# EAGLE design encoder_wrist (EAGLE 6.1)
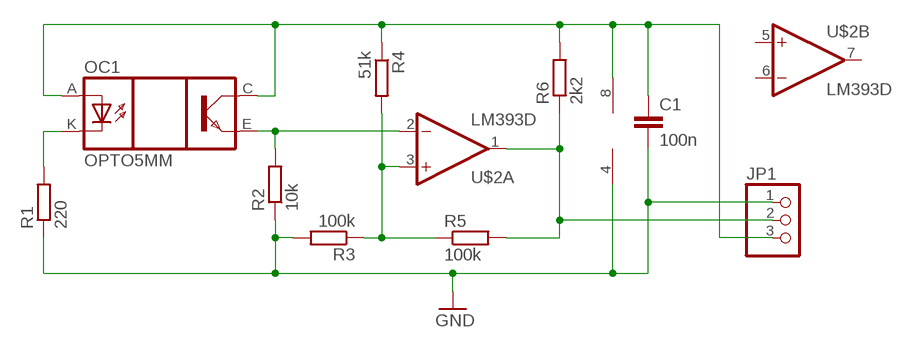
[diagram p0: schematic, sheet 1]

## Parts
C1  100n  C-EUC1206  [C1206]
JP1  PINHD-1X3/90  [1X03/90]
OC1  OPTO5MM  [OPTO_5MM]
R1  220  R-EU_M1206  [M1206]
R2  10k  R-EU_M1206  [M1206]
R3  100k  R-EU_M1206  [M1206]
R4  51k  R-EU_M1206  [M1206]
R5  100k  R-EU_M1206  [M1206]
R6  2k2  R-EU_M1206  [M1206]
U$2  LM393D  [SO08]

## Nets
GND: C1.2 JP1.1 R1.1 R2.1 R3.2 U$2.4(P:V-)
N$2: OC1.K(C) R1.2
N$3: R3.1 R4.2 R5.1 U$2.3(A:+IN)
N$5: JP1.2 R5.2 R6.1 U$2.1(A:OUT)
N$6: OC1.E(EMIT) R2.2 U$2.2(A:-IN)
N$8: C1.1 JP1.3 OC1.A OC1.C(COL) R4.1 R6.2 U$2.8(P:V+)
Unconnected: U$2.5(B:+IN) U$2.6(B:-IN) U$2.7(B:OUT)

## Library data of the parts
C1 = rcl:C-EU: CAPACITOR, European symbol
JP1 = pinhead:PINHD-1X3: PIN HEADER
OC1 = robot2:OPTO5MM
R1-R6 = rcl:R-EU_: RESISTOR, European symbol
U$2 = linear:LM393: COMPARATOR

## Board
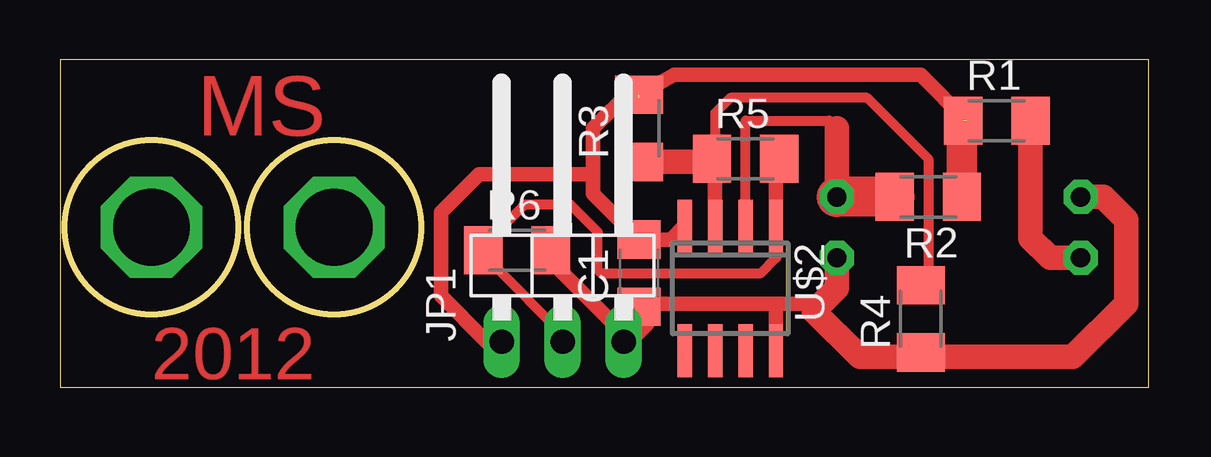
[diagram p1: board, top side]
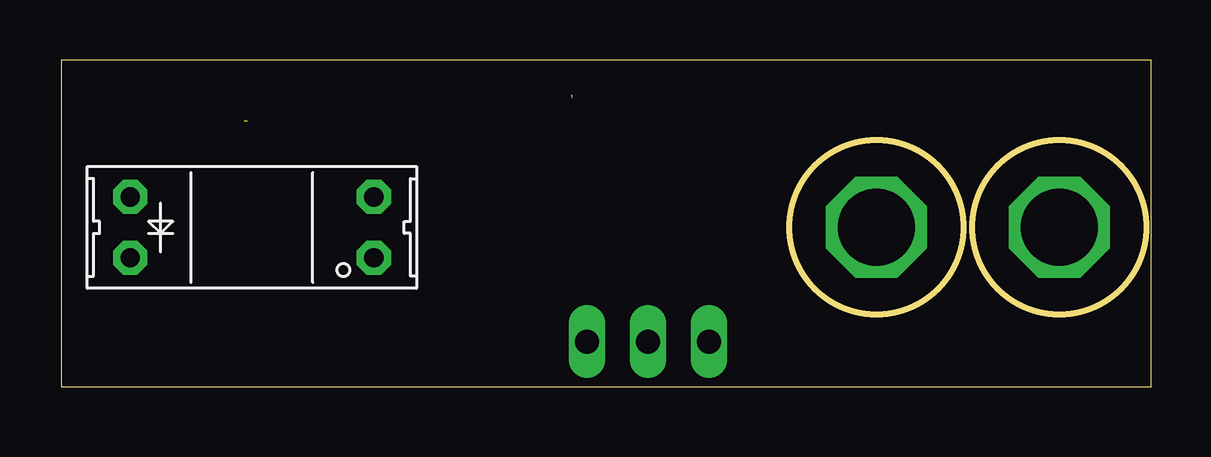
[diagram p2: board, bottom side, seen from below]

Size 45.39 x 13.64 mm. Coordinates in mm from the lower left corner, seen from the top.
Outline: 0,0 45.39,0 45.39,13.64 0,13.64 0,0
Outline: circle at 11.43,6.67 radius 3.62
Outline: circle at 3.81,6.67 radius 3.62
Copper layers (1*16): Top 0.035mm / dielectric 1.5mm / Bottom 0.035mm
Design rules: minimum track width 10mil, minimum drill 24mil, track to track 8mil, track to pad 8mil, pad to pad 8mil, via to via 8mil, smd to smd 8mil, copper to edge 40mil, drill to drill 8mil, minimum pad ring 10mil, minimum via ring 8mil, stop-mask expansion 4mil, vias tented up to drill 0mil, thermal gap 10mil

### Footprints (pad centres in the part's own frame; a part is rotated, then mirrored left to right if it is on the bottom)
C1206 = smd 1.6 x 1.8: 1 -1.4,0; 2 1.4,0
1X03/90 = drill 1.016 long: 1 -2.54,-3.81; 2 0,-3.81; 3 2.54,-3.81
OPTO_5MM = drill 0.8 pad 1.422 octagon: A 7.62,-2.54; C -2.54,0; E -2.54,-2.54; K 7.62,0
M1206 = smd 1.6 x 2: 1 -1.4,0; 2 1.4,0
SO08 = smd 0.6 x 2.2: 1 -1.905,-2.6; 2 -0.635,-2.6; 3 0.635,-2.6; 4 1.905,-2.6; 5 1.905,2.6; 6 0.635,2.6; 7 -0.635,2.6; 8 -1.905,2.6

### Placement (x,y rotation side)
C1  24.13,4.76 90 top
JP1  20.96,5.71 0 top
OC1  34.93,5.4 180 bottom
R1  39.05,11.11 0 top
R2  36.2,7.94 180 top
R3  24.13,10.79 90 top
R4  35.88,2.86 90 top
R5  28.58,9.53 0 top
R6  19.05,5.71 0 top
U$2  27.94,4.13 180 top

### Tracks (layer width: path | path; a pad name or v marks a point on that pad's centre or on a via)
GND  (2 unrouted)
  Top 0.61: U$2.4 25.47,6.16 C1.2 22.23,8.07 22.23,8.89 | R3.2 25.59,13.02 35.88,13.02 37.78,11.11 | 22.23,8.89 22.23,10.79 23.81,12.38 24.13,12.06 | JP1.1 17.78,1.91 15.88,3.81 15.88,7.3 17.46,8.89 22.23,8.89
  Top 1.27: R2.1 37.59,11.05 R1.1
N$1  (via drill 3.2)
  other vias: 11.43,6.67
N$2
  Top 1.016: R1.2 40.45,6.22 41.27,5.4 OC1.K
N$3
  Top 0.406: 27.3,9.65 27.3,11.43 27.94,12.06 33.66,12.06 36.2,9.53 36.2,4.58 R4.2
  Top 0.61: U$2.3 27.3,9.39 R5.1
  Top 0.813: 27.3,9.65 R5.1
  Top 1.016: R3.1 27.05,9.39 R5.1
N$4  (via drill 3.2)
  other vias: 3.81,6.67
N$5
  Top 0.406: U$2.1 29.85,5.4 29.21,4.76 22.54,4.76 22.41,4.89 22.41,6.48 21.27,7.62 19.37,7.62 18.1,6.35 18.1,6.16 R6.1 18.1,5.27 18.1,5.08 20.96,2.22 JP1.2
  Top 0.61: U$2.1 29.85,9.39 R5.2
N$6
  Top 0.406: U$2.2 28.58,11.11 32.07,11.11 32.38,10.79
  Top 1.016: OC1.E 32.38,10.79
  Top 1.676: R2.2 OC1.E
N$8
  Top 0.61: 29.85,3.49 31.43,3.49 31.43,3.17 | 29.85,3.49 24.26,3.49 C1.1 | U$2.8 29.85,3.49 | R6.2 20.45,5.27 23.18,2.54 23.18,2.22 JP1.3
  Top 1.016: 36.06,1.27 42.23,1.27 44.45,3.49 44.45,6.99 43.5,7.94 OC1.A | 36.06,1.27 R4.1 | 36.06,1.27 33.34,1.27 31.43,3.17 32.38,4.13 OC1.C
  Top 1.422: JP1.3 23.5,2.22 24.13,2.86 C1.1

### Text on the board
Top: MS | 2012